# EAGLE schematic Schematic (EAGLE 9.7.0)
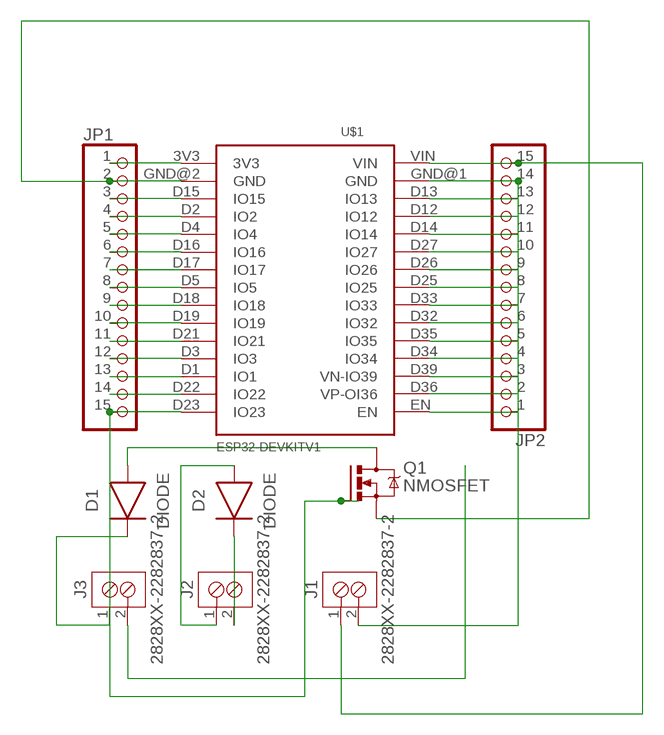
[diagram p0: schematic, sheet 1]

## Parts
D1  DIODE  DIODE_DO-213AA(SOD-80)  [DIOMELF3516]
D2  DIODE  DIODE_DO-213AA(SOD-80)  [DIOMELF3516]
J1  2828XX-2282837-2  [TERMBLK_508-2N]
J2  2828XX-2282837-2  [TERMBLK_508-2N]
J3  2828XX-2282837-2  [TERMBLK_508-2N]
JP1  PINHD-1X15  [1X15]
JP2  PINHD-1X15  [1X15]
Q1  NMOSFET  NMOSFET_SOT23  [SOT23]
U$1  ESP32DEVKITV1  [ESP32-DEVKITV1]

## Nets
N$1: JP1.15 Q1.1(G) U$1.D23(IO23)
N$2: JP1.14 U$1.D22(IO22)
N$3: JP1.13 U$1.D1(IO1)
N$4: JP1.12 U$1.D3(IO3)
N$5: JP1.11 U$1.D21(IO21)
N$6: JP1.10 U$1.D19(IO19)
N$7: JP1.9 U$1.D18(IO18)
N$8: JP1.8 U$1.D5(IO5)
N$9: JP1.7 U$1.D17(IO17)
N$10: JP1.6 U$1.D16(IO16)
N$11: JP1.5 U$1.D4(IO4)
N$12: JP1.4 U$1.D2(IO2)
N$13: JP1.3 U$1.D15(IO15)
N$15: JP1.1 U$1.3V3
N$16: JP2.1 U$1.EN
N$17: JP2.2 U$1.D36(VP-OI36)
N$18: JP2.3 U$1.D39(VN-IO39)
N$19: JP2.4 U$1.D34(IO34)
N$20: JP2.5 U$1.D35(IO35)
N$21: JP2.6 U$1.D32(IO32)
N$22: JP2.7 U$1.D33(IO33)
N$23: JP2.8 U$1.D25(IO25)
N$24: JP2.9 U$1.D26(IO26)
N$25: JP2.10 U$1.D27(IO27)
N$26: JP2.11 U$1.D14(IO14)
N$27: JP2.12 U$1.D12(IO12)
N$28: JP2.13 U$1.D13(IO13)
N$29: J1.2 JP2.14 U$1.GND@1(GND)
N$30: D2.1(C) J2.2
N$31: J3.2
N$32: J1.1 JP2.15 U$1.VIN
N$33: D2.2(A) J2.1
N$34: D1.1(C) J3.1
N$35: D1.2(A) Q1.3(D)
N$37: JP1.2 Q1.2(S) U$1.GND@2(GND)

## Library data of the parts
D1 D2 = Tinkercad:DIODE: Diode Rectifier - Generic
J1-J3 = Connector:2828XX-2: 2 Position Wire to Board Terminal Block Horizontal with Board
JP1 JP2 = pinhead:PINHD-1X15: PIN HEADER
Q1 = Tinkercad:NMOSFET: N-Channel MOSFET - Generic
U$1 = ESP32-DEVKITV1:ESP32DEVKITV1